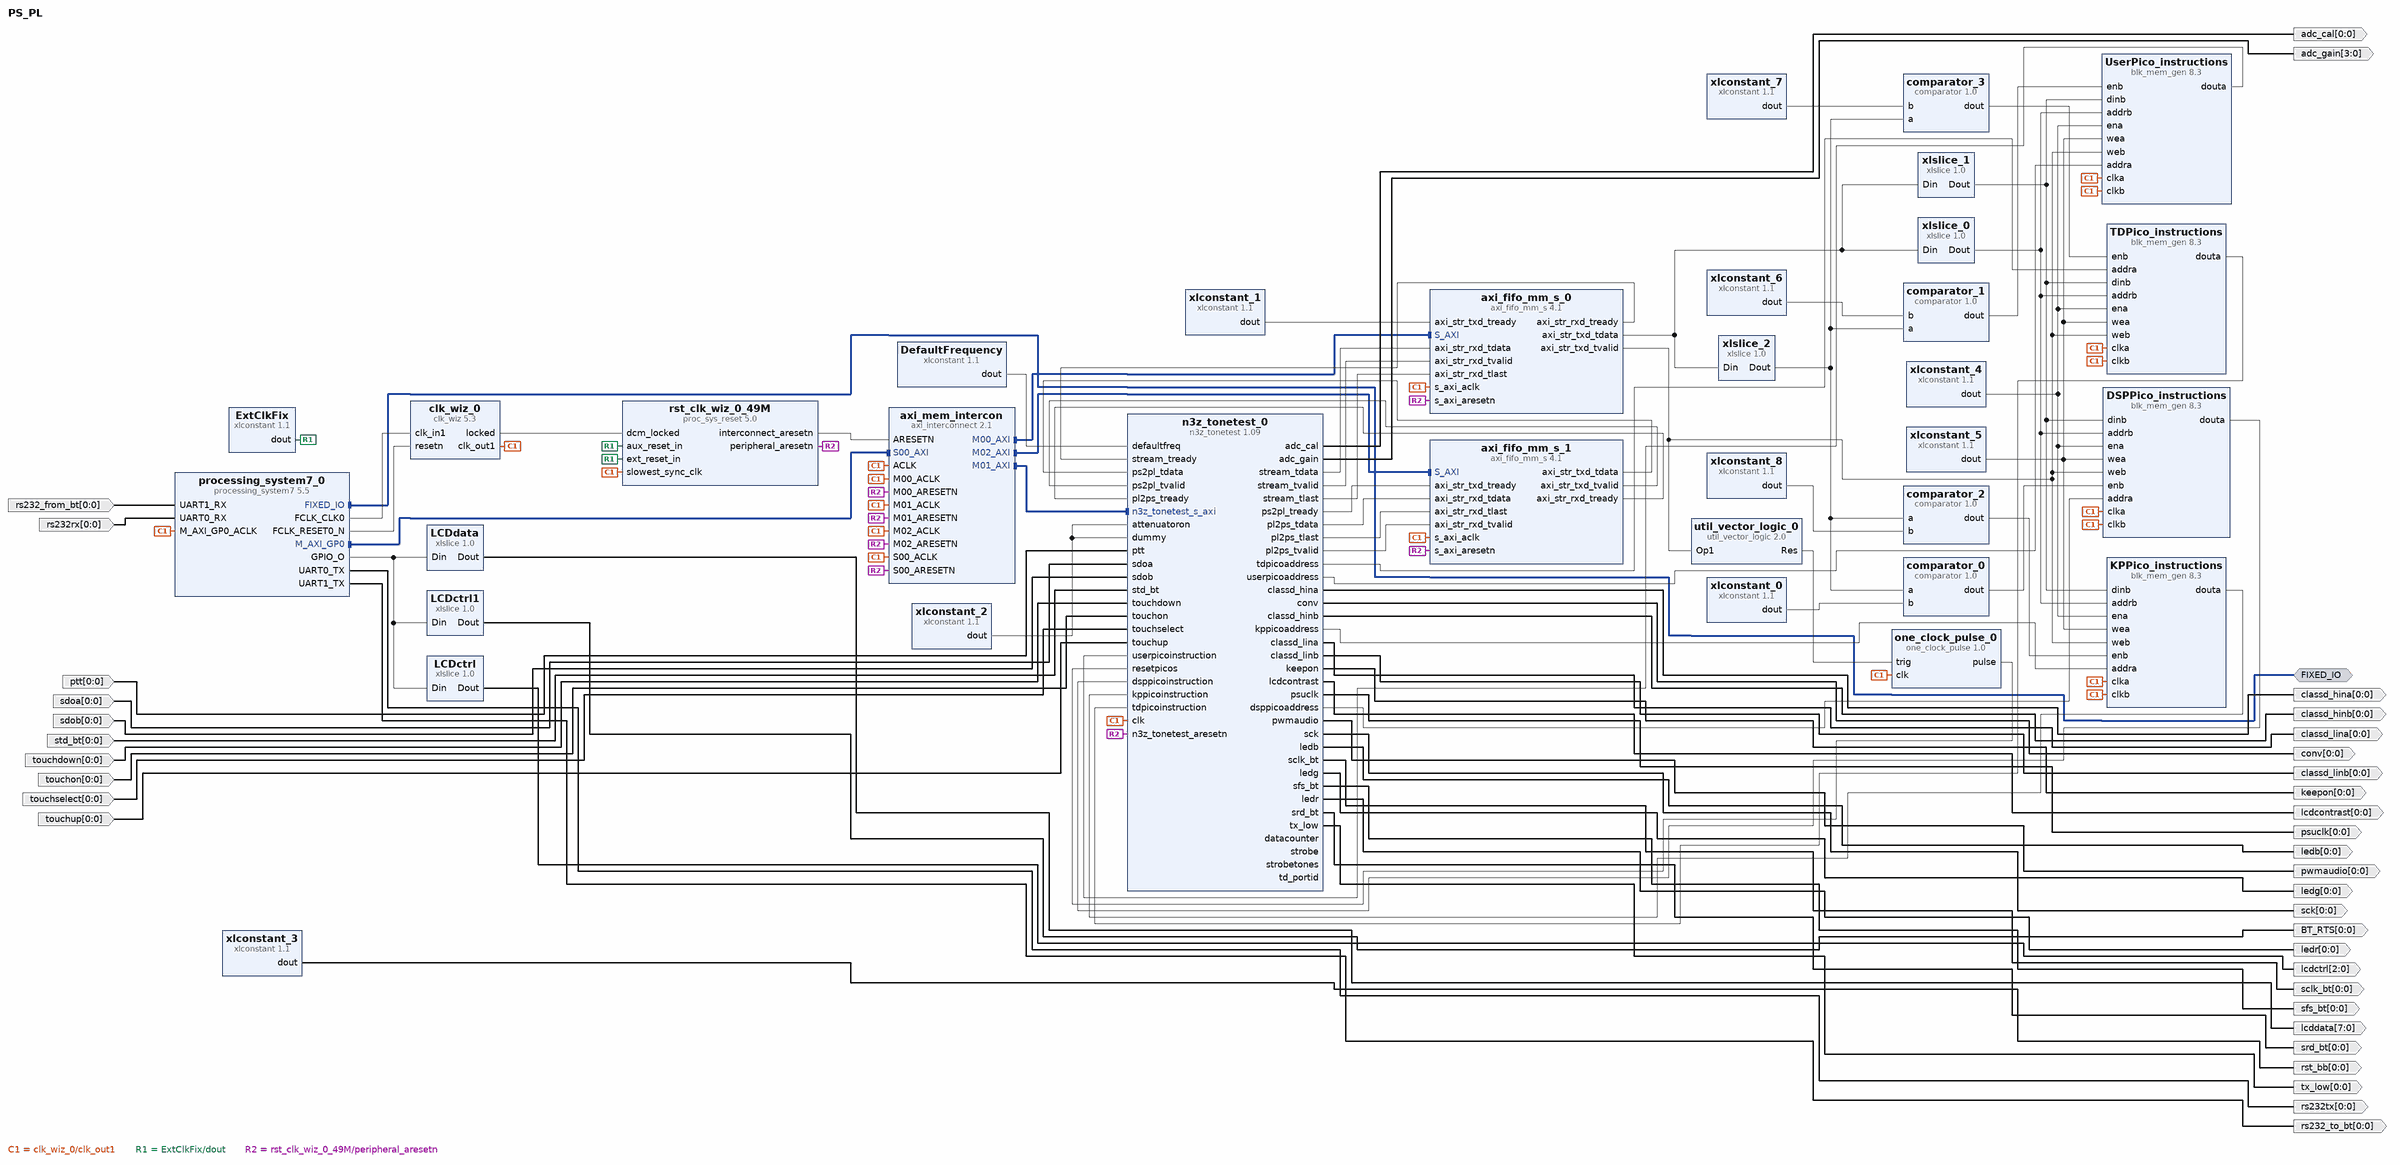
[diagram p0: block diagram of the top level]
# Vivado block design PS_PL, Vivado 2016.2
create_bd_design PS_PL

create_bd_intf_port -mode Master -vlnv xilinx.com:display_processing_system7:fixedio_rtl:1.0 FIXED_IO
create_bd_port -dir I -from 0 -to 0 -type data ptt
set_property -dict [list \
  CONFIG.LAYERED_METADATA {xilinx.com:interface:datatypes:1.0 {DATA {datatype {name {attribs {resolve_type immediate dependency {} format string minimum {} maximum {}} value {}} bitwidth {attribs {resolve_type immediate dependency {} format long minimum {} maximum {}} value 1} bitoffset {attribs {resolve_type immediate dependency {} format long minimum {} maximum {}} value 0} real {fixed {fractwidth {attribs {resolve_type immediate dependency {} format long minimum {} maximum {}} value 0} signed {attribs {resolve_type immediate dependency {} format bool minimum {} maximum {}} value false}}}}}}} \
] [get_bd_ports ptt]
create_bd_port -dir I -from 0 -to 0 -type data sdoa
set_property -dict [list \
  CONFIG.LAYERED_METADATA {xilinx.com:interface:datatypes:1.0 {DATA {datatype {name {attribs {resolve_type immediate dependency {} format string minimum {} maximum {}} value {}} bitwidth {attribs {resolve_type immediate dependency {} format long minimum {} maximum {}} value 1} bitoffset {attribs {resolve_type immediate dependency {} format long minimum {} maximum {}} value 0} real {fixed {fractwidth {attribs {resolve_type immediate dependency {} format long minimum {} maximum {}} value 0} signed {attribs {resolve_type immediate dependency {} format bool minimum {} maximum {}} value false}}}}}}} \
] [get_bd_ports sdoa]
create_bd_port -dir I -from 0 -to 0 -type data sdob
set_property -dict [list \
  CONFIG.LAYERED_METADATA {xilinx.com:interface:datatypes:1.0 {DATA {datatype {name {attribs {resolve_type immediate dependency {} format string minimum {} maximum {}} value {}} bitwidth {attribs {resolve_type immediate dependency {} format long minimum {} maximum {}} value 1} bitoffset {attribs {resolve_type immediate dependency {} format long minimum {} maximum {}} value 0} real {fixed {fractwidth {attribs {resolve_type immediate dependency {} format long minimum {} maximum {}} value 0} signed {attribs {resolve_type immediate dependency {} format bool minimum {} maximum {}} value false}}}}}}} \
] [get_bd_ports sdob]
create_bd_port -dir I -from 0 -to 0 -type data std_bt
set_property -dict [list \
  CONFIG.LAYERED_METADATA {xilinx.com:interface:datatypes:1.0 {DATA {datatype {name {attribs {resolve_type immediate dependency {} format string minimum {} maximum {}} value {}} bitwidth {attribs {resolve_type immediate dependency {} format long minimum {} maximum {}} value 1} bitoffset {attribs {resolve_type immediate dependency {} format long minimum {} maximum {}} value 0} real {fixed {fractwidth {attribs {resolve_type immediate dependency {} format long minimum {} maximum {}} value 0} signed {attribs {resolve_type immediate dependency {} format bool minimum {} maximum {}} value false}}}}}}} \
] [get_bd_ports std_bt]
create_bd_port -dir I -from 0 -to 0 -type data touchdown
set_property -dict [list \
  CONFIG.LAYERED_METADATA {xilinx.com:interface:datatypes:1.0 {DATA {datatype {name {attribs {resolve_type immediate dependency {} format string minimum {} maximum {}} value {}} bitwidth {attribs {resolve_type immediate dependency {} format long minimum {} maximum {}} value 1} bitoffset {attribs {resolve_type immediate dependency {} format long minimum {} maximum {}} value 0} real {fixed {fractwidth {attribs {resolve_type immediate dependency {} format long minimum {} maximum {}} value 0} signed {attribs {resolve_type immediate dependency {} format bool minimum {} maximum {}} value false}}}}}}} \
] [get_bd_ports touchdown]
create_bd_port -dir I -from 0 -to 0 -type data touchon
set_property -dict [list \
  CONFIG.LAYERED_METADATA {xilinx.com:interface:datatypes:1.0 {DATA {datatype {name {attribs {resolve_type immediate dependency {} format string minimum {} maximum {}} value {}} bitwidth {attribs {resolve_type immediate dependency {} format long minimum {} maximum {}} value 1} bitoffset {attribs {resolve_type immediate dependency {} format long minimum {} maximum {}} value 0} real {fixed {fractwidth {attribs {resolve_type immediate dependency {} format long minimum {} maximum {}} value 0} signed {attribs {resolve_type immediate dependency {} format bool minimum {} maximum {}} value false}}}}}}} \
] [get_bd_ports touchon]
create_bd_port -dir I -from 0 -to 0 -type data touchselect
set_property -dict [list \
  CONFIG.LAYERED_METADATA {xilinx.com:interface:datatypes:1.0 {DATA {datatype {name {attribs {resolve_type immediate dependency {} format string minimum {} maximum {}} value {}} bitwidth {attribs {resolve_type immediate dependency {} format long minimum {} maximum {}} value 1} bitoffset {attribs {resolve_type immediate dependency {} format long minimum {} maximum {}} value 0} real {fixed {fractwidth {attribs {resolve_type immediate dependency {} format long minimum {} maximum {}} value 0} signed {attribs {resolve_type immediate dependency {} format bool minimum {} maximum {}} value false}}}}}}} \
] [get_bd_ports touchselect]
create_bd_port -dir I -from 0 -to 0 -type data touchup
set_property -dict [list \
  CONFIG.LAYERED_METADATA {xilinx.com:interface:datatypes:1.0 {DATA {datatype {name {attribs {resolve_type immediate dependency {} format string minimum {} maximum {}} value {}} bitwidth {attribs {resolve_type immediate dependency {} format long minimum {} maximum {}} value 1} bitoffset {attribs {resolve_type immediate dependency {} format long minimum {} maximum {}} value 0} real {fixed {fractwidth {attribs {resolve_type immediate dependency {} format long minimum {} maximum {}} value 0} signed {attribs {resolve_type immediate dependency {} format bool minimum {} maximum {}} value false}}}}}}} \
] [get_bd_ports touchup]
create_bd_port -dir O -from 0 -to 0 -type data adc_cal
create_bd_port -dir O -from 3 -to 0 -type data adc_gain
create_bd_port -dir O -from 0 -to 0 -type data conv
create_bd_port -dir O -from 0 -to 0 -type data classd_hina
create_bd_port -dir O -from 0 -to 0 -type data classd_hinb
create_bd_port -dir O -from 0 -to 0 -type data classd_lina
create_bd_port -dir O -from 0 -to 0 -type data classd_linb
create_bd_port -dir O -from 0 -to 0 -type data keepon
create_bd_port -dir O -from 0 -to 0 -type data lcdcontrast
create_bd_port -dir O -from 0 -to 0 -type data psuclk
create_bd_port -dir O -from 0 -to 0 -type data pwmaudio
create_bd_port -dir O -from 0 -to 0 -type data rst_bb
create_bd_port -dir O -from 0 -to 0 -type data sck
create_bd_port -dir O -from 0 -to 0 -type data sclk_bt
create_bd_port -dir O -from 0 -to 0 -type data sfs_bt
create_bd_port -dir O -from 0 -to 0 -type data srd_bt
create_bd_port -dir O -from 0 -to 0 -type data tx_low
create_bd_port -dir O -from 0 -to 0 -type data rs232tx
create_bd_port -dir O -from 0 -to 0 -type data rs232_to_bt
create_bd_port -dir I -from 0 -to 0 -type data rs232_from_bt
set_property -dict [list \
  CONFIG.LAYERED_METADATA {xilinx.com:interface:datatypes:1.0 {DATA {datatype {name {attribs {resolve_type immediate dependency {} format string minimum {} maximum {}} value {}} bitwidth {attribs {resolve_type immediate dependency {} format long minimum {} maximum {}} value 1} bitoffset {attribs {resolve_type immediate dependency {} format long minimum {} maximum {}} value 0} real {fixed {fractwidth {attribs {resolve_type immediate dependency {} format long minimum {} maximum {}} value 0} signed {attribs {resolve_type immediate dependency {} format bool minimum {} maximum {}} value false}}}}}}} \
] [get_bd_ports rs232_from_bt]
create_bd_port -dir I -from 0 -to 0 -type data rs232rx
set_property -dict [list \
  CONFIG.LAYERED_METADATA {xilinx.com:interface:datatypes:1.0 {DATA {datatype {name {attribs {resolve_type immediate dependency {} format string minimum {} maximum {}} value {}} bitwidth {attribs {resolve_type immediate dependency {} format long minimum {} maximum {}} value 1} bitoffset {attribs {resolve_type immediate dependency {} format long minimum {} maximum {}} value 0} real {fixed {fractwidth {attribs {resolve_type immediate dependency {} format long minimum {} maximum {}} value 0} signed {attribs {resolve_type immediate dependency {} format bool minimum {} maximum {}} value false}}}}}}} \
] [get_bd_ports rs232rx]
create_bd_port -dir O -from 2 -to 0 -type data lcdctrl
create_bd_port -dir O -from 7 -to 0 -type data lcddata
create_bd_port -dir O -from 0 -to 0 -type data ledb
create_bd_port -dir O -from 0 -to 0 -type data ledg
create_bd_port -dir O -from 0 -to 0 -type data ledr
create_bd_port -dir O -from 0 -to 0 BT_RTS

create_bd_cell -type ip -vlnv xilinx.com:ip:clk_wiz:5.3 clk_wiz_0
set_property -dict [list \
  CONFIG.PRIM_IN_FREQ 50 \
  CONFIG.CLKIN1_JITTER_PS 200.0 \
  CONFIG.CLKOUT1_REQUESTED_OUT_FREQ 49.152 \
  CONFIG.RESET_TYPE ACTIVE_LOW \
  CONFIG.CLKOUT1_JITTER 177.254 \
  CONFIG.CLKOUT1_PHASE_ERROR 162.020 \
] [get_bd_cells clk_wiz_0]
create_bd_cell -type ip -vlnv xilinx.com:ip:processing_system7:5.5 processing_system7_0
set_property -dict [list \
  CONFIG.PCW_SDIO_PERIPHERAL_FREQMHZ 125 \
  CONFIG.PCW_UIPARAM_DDR_ENABLE 0 \
  CONFIG.PCW_QSPI_PERIPHERAL_ENABLE 1 \
  CONFIG.PCW_QSPI_GRP_SINGLE_SS_ENABLE 1 \
  CONFIG.PCW_SD0_PERIPHERAL_ENABLE 1 \
  CONFIG.PCW_SD0_SD0_IO {MIO 28 .. 33} \
  CONFIG.PCW_UART0_PERIPHERAL_ENABLE 1 \
  CONFIG.PCW_UART1_PERIPHERAL_ENABLE 1 \
  CONFIG.PCW_UART1_UART1_IO EMIO \
  CONFIG.PCW_GPIO_MIO_GPIO_ENABLE 0 \
  CONFIG.PCW_GPIO_EMIO_GPIO_ENABLE 1 \
  CONFIG.PCW_GPIO_EMIO_GPIO_IO 16 \
] [get_bd_cells processing_system7_0]
# 2 more settings of processing_system7_0 are not shown: defaults, MIO pin electricals, DDR timing, and values the tool derives
create_bd_cell -type ip -vlnv xilinx.com:ip:proc_sys_reset:5.0 rst_clk_wiz_0_49M
set_property -dict {CONFIG.C_AUX_RESET_HIGH 0} [get_bd_cells rst_clk_wiz_0_49M]
create_bd_cell -type ip -vlnv xilinx.com:ip:xlconstant:1.1 DefaultFrequency
set_property -dict {CONFIG.CONST_WIDTH 2 CONFIG.CONST_VAL 1} [get_bd_cells DefaultFrequency]
create_bd_cell -type ip -vlnv xilinx.com:ip:xlconstant:1.1 xlconstant_2
create_bd_cell -type ip -vlnv xilinx.com:ip:xlconstant:1.1 ExtClkFix
set_property -dict {CONFIG.CONST_WIDTH 4 CONFIG.CONST_VAL 15} [get_bd_cells ExtClkFix]
create_bd_cell -type ip -vlnv xilinx.com:ip:axi_interconnect:2.1 axi_mem_intercon
set_property -dict [list \
  CONFIG.NUM_MI 3 \
  CONFIG.M01_HAS_REGSLICE 0 \
  CONFIG.M01_HAS_DATA_FIFO 0 \
  CONFIG.S00_HAS_DATA_FIFO 0 \
] [get_bd_cells axi_mem_intercon]
create_bd_cell -type ip -vlnv xilinx.com:ip:axi_fifo_mm_s:4.1 axi_fifo_mm_s_0
set_property -dict [list \
  CONFIG.C_RX_FIFO_PE_THRESHOLD 2 \
  CONFIG.C_RX_FIFO_PF_THRESHOLD 4000 \
  CONFIG.C_TX_FIFO_PE_THRESHOLD 2 \
  CONFIG.C_TX_FIFO_PF_THRESHOLD 2043 \
  CONFIG.C_RX_FIFO_DEPTH 16384 \
  CONFIG.C_TX_FIFO_DEPTH 2048 \
  CONFIG.C_HAS_AXIS_TUSER false \
  CONFIG.C_HAS_AXIS_TDEST false \
  CONFIG.C_AXIS_TUSER_WIDTH 4 \
  CONFIG.C_AXIS_TDEST_WIDTH 4 \
  CONFIG.C_USE_TX_DATA 1 \
  CONFIG.C_USE_RX_DATA 1 \
  CONFIG.C_USE_TX_CTRL 0 \
] [get_bd_cells axi_fifo_mm_s_0]
create_bd_cell -type ip -vlnv xilinx.com:ip:xlconstant:1.1 xlconstant_3
set_property -dict {CONFIG.CONST_VAL 0} [get_bd_cells xlconstant_3]
create_bd_cell -type ip -vlnv xilinx.com:ip:axi_fifo_mm_s:4.1 axi_fifo_mm_s_1
set_property -dict [list \
  CONFIG.C_HAS_AXIS_TDEST false \
  CONFIG.C_AXIS_TDEST_WIDTH 4 \
  CONFIG.C_USE_TX_CTRL 0 \
] [get_bd_cells axi_fifo_mm_s_1]
create_bd_cell -type ip -vlnv xilinx.com:ip:xlslice:1.0 LCDdata
set_property -dict {CONFIG.DOUT_WIDTH 8 CONFIG.DIN_TO 0 CONFIG.DIN_FROM 7 CONFIG.DIN_WIDTH 16} [get_bd_cells LCDdata]
create_bd_cell -type ip -vlnv xilinx.com:ip:xlslice:1.0 LCDctrl
set_property -dict {CONFIG.DOUT_WIDTH 3 CONFIG.DIN_TO 8 CONFIG.DIN_FROM 10 CONFIG.DIN_WIDTH 16} [get_bd_cells LCDctrl]
create_bd_cell -type ip -vlnv xilinx.com:ip:xlconstant:1.1 xlconstant_0
set_property -dict {CONFIG.CONST_WIDTH 3 CONFIG.CONST_VAL 1} [get_bd_cells xlconstant_0]
create_bd_cell -type ip -vlnv xilinx.com:ip:xlslice:1.0 xlslice_0
set_property -dict {CONFIG.DOUT_WIDTH 11 CONFIG.DIN_FROM 10} [get_bd_cells xlslice_0]
create_bd_cell -type ip -vlnv xilinx.com:ip:xlslice:1.0 xlslice_1
set_property -dict {CONFIG.DOUT_WIDTH 18 CONFIG.DIN_TO 11 CONFIG.DIN_FROM 28} [get_bd_cells xlslice_1]
create_bd_cell -type ip -vlnv xilinx.com:ip:xlslice:1.0 xlslice_2
set_property -dict {CONFIG.DOUT_WIDTH 3 CONFIG.DIN_TO 29 CONFIG.DIN_FROM 31} [get_bd_cells xlslice_2]
create_bd_cell -type ip -vlnv xilinx.com:ip:xlconstant:1.1 xlconstant_1
create_bd_cell -type ip -vlnv xilinx.com:ip:xlconstant:1.1 xlconstant_4
create_bd_cell -type ip -vlnv xilinx.com:ip:xlconstant:1.1 xlconstant_5
set_property -dict {CONFIG.CONST_VAL 0} [get_bd_cells xlconstant_5]
create_bd_cell -type ip -vlnv koheron:user:comparator:1.0 comparator_0
set_property -dict {CONFIG.DATA_WIDTH 3} [get_bd_cells comparator_0]
create_bd_cell -type ip -vlnv koheron:user:comparator:1.0 comparator_1
set_property -dict {CONFIG.DATA_WIDTH 3} [get_bd_cells comparator_1]
create_bd_cell -type ip -vlnv xilinx.com:ip:xlconstant:1.1 xlconstant_6
set_property -dict {CONFIG.CONST_WIDTH 3 CONFIG.CONST_VAL 0} [get_bd_cells xlconstant_6]
create_bd_cell -type ip -vlnv koheron:user:comparator:1.0 comparator_2
set_property -dict {CONFIG.DATA_WIDTH 3} [get_bd_cells comparator_2]
create_bd_cell -type ip -vlnv koheron:user:comparator:1.0 comparator_3
set_property -dict {CONFIG.DATA_WIDTH 3} [get_bd_cells comparator_3]
create_bd_cell -type ip -vlnv xilinx.com:ip:xlconstant:1.1 xlconstant_7
set_property -dict {CONFIG.CONST_WIDTH 3 CONFIG.CONST_VAL 3} [get_bd_cells xlconstant_7]
create_bd_cell -type ip -vlnv xilinx.com:ip:xlconstant:1.1 xlconstant_8
set_property -dict {CONFIG.CONST_WIDTH 3 CONFIG.CONST_VAL 2} [get_bd_cells xlconstant_8]
create_bd_cell -type ip -vlnv CCFE:user:one_clock_pulse:1.0 one_clock_pulse_0
create_bd_cell -type ip -vlnv xilinx.com:ip:util_vector_logic:2.0 util_vector_logic_0
set_property -dict {CONFIG.C_SIZE 1 CONFIG.C_OPERATION not} [get_bd_cells util_vector_logic_0]
create_bd_cell -type ip -vlnv xilinx.com:ip:blk_mem_gen:8.3 UserPico_instructions
set_property -dict [list \
  CONFIG.Memory_Type True_Dual_Port_RAM \
  CONFIG.Enable_32bit_Address false \
  CONFIG.Use_Byte_Write_Enable false \
  CONFIG.Write_Width_A 18 \
  CONFIG.Write_Depth_A 2048 \
  CONFIG.Read_Width_A 18 \
  CONFIG.Write_Width_B 18 \
  CONFIG.Read_Width_B 18 \
  CONFIG.Operating_Mode_B READ_FIRST \
  CONFIG.Enable_B Use_ENB_Pin \
  CONFIG.Register_PortA_Output_of_Memory_Primitives false \
  CONFIG.Register_PortB_Output_of_Memory_Primitives false \
  CONFIG.Load_Init_File true \
  CONFIG.Coe_File ../../../../../../../../../../N3SysGen/UserPico.coe \
  CONFIG.Use_RSTA_Pin false \
  CONFIG.Use_RSTB_Pin false \
  CONFIG.Port_B_Clock 100 \
  CONFIG.Port_B_Write_Rate 50 \
  CONFIG.Port_B_Enable_Rate 100 \
  CONFIG.use_bram_block Stand_Alone \
] [get_bd_cells UserPico_instructions]
create_bd_cell -type ip -vlnv xilinx.com:ip:blk_mem_gen:8.3 DSPPico_instructions
set_property -dict [list \
  CONFIG.Memory_Type True_Dual_Port_RAM \
  CONFIG.Enable_32bit_Address false \
  CONFIG.Use_Byte_Write_Enable false \
  CONFIG.Write_Width_A 18 \
  CONFIG.Write_Depth_A 2048 \
  CONFIG.Read_Width_A 18 \
  CONFIG.Write_Width_B 18 \
  CONFIG.Read_Width_B 18 \
  CONFIG.Operating_Mode_B READ_FIRST \
  CONFIG.Enable_B Use_ENB_Pin \
  CONFIG.Register_PortA_Output_of_Memory_Primitives false \
  CONFIG.Register_PortB_Output_of_Memory_Primitives false \
  CONFIG.Load_Init_File true \
  CONFIG.Coe_File ../../../../../../../../../../N3SysGen/DSPpico.coe \
  CONFIG.Use_RSTA_Pin false \
  CONFIG.Use_RSTB_Pin false \
  CONFIG.Port_B_Clock 100 \
  CONFIG.Port_B_Write_Rate 50 \
  CONFIG.Port_B_Enable_Rate 100 \
  CONFIG.use_bram_block Stand_Alone \
] [get_bd_cells DSPPico_instructions]
create_bd_cell -type ip -vlnv xilinx.com:ip:blk_mem_gen:8.3 KPPico_instructions
set_property -dict [list \
  CONFIG.Memory_Type True_Dual_Port_RAM \
  CONFIG.Enable_32bit_Address false \
  CONFIG.Use_Byte_Write_Enable false \
  CONFIG.Write_Width_A 18 \
  CONFIG.Write_Depth_A 2048 \
  CONFIG.Read_Width_A 18 \
  CONFIG.Write_Width_B 18 \
  CONFIG.Read_Width_B 18 \
  CONFIG.Operating_Mode_B READ_FIRST \
  CONFIG.Enable_B Use_ENB_Pin \
  CONFIG.Register_PortA_Output_of_Memory_Primitives false \
  CONFIG.Register_PortB_Output_of_Memory_Primitives false \
  CONFIG.Load_Init_File true \
  CONFIG.Coe_File ../../../../../../../../../../N3SysGen/KeyPadPico.coe \
  CONFIG.Use_RSTA_Pin false \
  CONFIG.Use_RSTB_Pin false \
  CONFIG.Port_B_Clock 100 \
  CONFIG.Port_B_Write_Rate 50 \
  CONFIG.Port_B_Enable_Rate 100 \
  CONFIG.use_bram_block Stand_Alone \
] [get_bd_cells KPPico_instructions]
create_bd_cell -type ip -vlnv xilinx.com:ip:blk_mem_gen:8.3 TDPico_instructions
set_property -dict [list \
  CONFIG.Memory_Type True_Dual_Port_RAM \
  CONFIG.Enable_32bit_Address false \
  CONFIG.Use_Byte_Write_Enable false \
  CONFIG.Write_Width_A 18 \
  CONFIG.Write_Depth_A 2048 \
  CONFIG.Read_Width_A 18 \
  CONFIG.Write_Width_B 18 \
  CONFIG.Read_Width_B 18 \
  CONFIG.Operating_Mode_B READ_FIRST \
  CONFIG.Enable_B Use_ENB_Pin \
  CONFIG.Register_PortA_Output_of_Memory_Primitives false \
  CONFIG.Register_PortB_Output_of_Memory_Primitives false \
  CONFIG.Load_Init_File true \
  CONFIG.Coe_File ../../../../../../../../../../N3SysGen/ToneDetectpico.coe \
  CONFIG.Use_RSTA_Pin false \
  CONFIG.Use_RSTB_Pin false \
  CONFIG.Port_B_Clock 100 \
  CONFIG.Port_B_Write_Rate 50 \
  CONFIG.Port_B_Enable_Rate 100 \
  CONFIG.use_bram_block Stand_Alone \
] [get_bd_cells TDPico_instructions]
create_bd_cell -type ip -vlnv AssociationNicola:SysGen:n3z_tonetest:1.09 n3z_tonetest_0
create_bd_cell -type ip -vlnv xilinx.com:ip:xlslice:1.0 LCDctrl1
set_property -dict {CONFIG.DOUT_WIDTH 1 CONFIG.DIN_TO 12 CONFIG.DIN_FROM 12 CONFIG.DIN_WIDTH 16} [get_bd_cells LCDctrl1]

# ---- connections ----

connect_bd_intf_net [get_bd_intf_pins processing_system7_0/M_AXI_GP0] [get_bd_intf_pins axi_mem_intercon/S00_AXI]
connect_bd_intf_net [get_bd_intf_pins axi_mem_intercon/M01_AXI] [get_bd_intf_pins n3z_tonetest_0/n3z_tonetest_s_axi]
connect_bd_intf_net [get_bd_intf_pins axi_mem_intercon/M00_AXI] [get_bd_intf_pins axi_fifo_mm_s_0/S_AXI]
connect_bd_intf_net [get_bd_intf_pins axi_mem_intercon/M02_AXI] [get_bd_intf_pins axi_fifo_mm_s_1/S_AXI]
connect_bd_intf_net [get_bd_intf_ports FIXED_IO] [get_bd_intf_pins processing_system7_0/FIXED_IO]
connect_bd_net [get_bd_pins processing_system7_0/FCLK_CLK0] [get_bd_pins clk_wiz_0/clk_in1]
connect_bd_net [get_bd_pins processing_system7_0/FCLK_RESET0_N] [get_bd_pins clk_wiz_0/resetn]
connect_bd_net [get_bd_pins DefaultFrequency/dout] [get_bd_pins n3z_tonetest_0/defaultfreq]
connect_bd_net [get_bd_ports ptt] [get_bd_pins n3z_tonetest_0/ptt]
connect_bd_net [get_bd_ports sdoa] [get_bd_pins n3z_tonetest_0/sdoa]
connect_bd_net [get_bd_ports sdob] [get_bd_pins n3z_tonetest_0/sdob]
connect_bd_net [get_bd_ports std_bt] [get_bd_pins n3z_tonetest_0/std_bt]
connect_bd_net [get_bd_ports touchdown] [get_bd_pins n3z_tonetest_0/touchdown]
connect_bd_net [get_bd_ports touchon] [get_bd_pins n3z_tonetest_0/touchon]
connect_bd_net [get_bd_ports touchselect] [get_bd_pins n3z_tonetest_0/touchselect]
connect_bd_net [get_bd_ports touchup] [get_bd_pins n3z_tonetest_0/touchup]
connect_bd_net [get_bd_pins n3z_tonetest_0/adc_cal] [get_bd_ports adc_cal]
connect_bd_net [get_bd_pins n3z_tonetest_0/adc_gain] [get_bd_ports adc_gain]
connect_bd_net [get_bd_pins n3z_tonetest_0/conv] [get_bd_ports conv]
connect_bd_net [get_bd_pins n3z_tonetest_0/classd_hina] [get_bd_ports classd_hina]
connect_bd_net [get_bd_pins n3z_tonetest_0/classd_hinb] [get_bd_ports classd_hinb]
connect_bd_net [get_bd_pins n3z_tonetest_0/classd_lina] [get_bd_ports classd_lina]
connect_bd_net [get_bd_pins n3z_tonetest_0/classd_linb] [get_bd_ports classd_linb]
connect_bd_net [get_bd_pins n3z_tonetest_0/keepon] [get_bd_ports keepon]
connect_bd_net [get_bd_pins n3z_tonetest_0/lcdcontrast] [get_bd_ports lcdcontrast]
connect_bd_net [get_bd_pins n3z_tonetest_0/psuclk] [get_bd_ports psuclk]
connect_bd_net [get_bd_pins n3z_tonetest_0/pwmaudio] [get_bd_ports pwmaudio]
connect_bd_net -net n3z_tonetest_0_rst_bb [get_bd_pins xlconstant_3/dout] [get_bd_ports rst_bb]
connect_bd_net [get_bd_pins n3z_tonetest_0/sck] [get_bd_ports sck]
connect_bd_net [get_bd_pins n3z_tonetest_0/sclk_bt] [get_bd_ports sclk_bt]
connect_bd_net [get_bd_pins n3z_tonetest_0/sfs_bt] [get_bd_ports sfs_bt]
connect_bd_net [get_bd_pins n3z_tonetest_0/srd_bt] [get_bd_ports srd_bt]
connect_bd_net [get_bd_pins n3z_tonetest_0/tx_low] [get_bd_ports tx_low]
connect_bd_net [get_bd_pins clk_wiz_0/locked] [get_bd_pins rst_clk_wiz_0_49M/dcm_locked]
connect_bd_net [get_bd_pins clk_wiz_0/clk_out1] \
  [get_bd_pins processing_system7_0/M_AXI_GP0_ACLK] [get_bd_pins rst_clk_wiz_0_49M/slowest_sync_clk] \
  [get_bd_pins axi_fifo_mm_s_0/s_axi_aclk] [get_bd_pins axi_fifo_mm_s_1/s_axi_aclk] [get_bd_pins one_clock_pulse_0/clk] \
  [get_bd_pins UserPico_instructions/clka] [get_bd_pins UserPico_instructions/clkb] [get_bd_pins DSPPico_instructions/clka] \
  [get_bd_pins DSPPico_instructions/clkb] [get_bd_pins KPPico_instructions/clka] [get_bd_pins KPPico_instructions/clkb] \
  [get_bd_pins TDPico_instructions/clka] [get_bd_pins TDPico_instructions/clkb] [get_bd_pins axi_mem_intercon/S00_ACLK] \
  [get_bd_pins axi_mem_intercon/ACLK] [get_bd_pins axi_mem_intercon/M00_ACLK] [get_bd_pins axi_mem_intercon/M01_ACLK] \
  [get_bd_pins axi_mem_intercon/M02_ACLK] [get_bd_pins n3z_tonetest_0/clk]
connect_bd_net [get_bd_pins xlconstant_2/dout] [get_bd_pins n3z_tonetest_0/attenuatoron] [get_bd_pins n3z_tonetest_0/dummy]
connect_bd_net -net DefaultFrequency1_dout [get_bd_pins ExtClkFix/dout] \
  [get_bd_pins rst_clk_wiz_0_49M/ext_reset_in] [get_bd_pins rst_clk_wiz_0_49M/aux_reset_in]
connect_bd_net [get_bd_pins processing_system7_0/UART0_TX] [get_bd_ports rs232tx]
connect_bd_net [get_bd_pins processing_system7_0/UART1_TX] [get_bd_ports rs232_to_bt]
connect_bd_net [get_bd_ports rs232_from_bt] [get_bd_pins processing_system7_0/UART1_RX]
connect_bd_net [get_bd_ports rs232rx] [get_bd_pins processing_system7_0/UART0_RX]
connect_bd_net [get_bd_pins rst_clk_wiz_0_49M/interconnect_aresetn] [get_bd_pins axi_mem_intercon/ARESETN]
connect_bd_net [get_bd_pins rst_clk_wiz_0_49M/peripheral_aresetn] \
  [get_bd_pins axi_fifo_mm_s_0/s_axi_aresetn] [get_bd_pins axi_fifo_mm_s_1/s_axi_aresetn] \
  [get_bd_pins axi_mem_intercon/S00_ARESETN] [get_bd_pins axi_mem_intercon/M00_ARESETN] \
  [get_bd_pins axi_mem_intercon/M01_ARESETN] [get_bd_pins axi_mem_intercon/M02_ARESETN] \
  [get_bd_pins n3z_tonetest_0/n3z_tonetest_aresetn]
connect_bd_net [get_bd_pins n3z_tonetest_0/stream_tdata] [get_bd_pins axi_fifo_mm_s_0/axi_str_rxd_tdata]
connect_bd_net [get_bd_pins n3z_tonetest_0/stream_tvalid] [get_bd_pins axi_fifo_mm_s_0/axi_str_rxd_tvalid]
connect_bd_net [get_bd_pins axi_fifo_mm_s_1/axi_str_txd_tdata] [get_bd_pins n3z_tonetest_0/ps2pl_tdata]
connect_bd_net [get_bd_pins axi_fifo_mm_s_1/axi_str_txd_tvalid] [get_bd_pins n3z_tonetest_0/ps2pl_tvalid]
connect_bd_net [get_bd_pins n3z_tonetest_0/ps2pl_tready] [get_bd_pins axi_fifo_mm_s_1/axi_str_txd_tready]
connect_bd_net [get_bd_pins n3z_tonetest_0/pl2ps_tdata] [get_bd_pins axi_fifo_mm_s_1/axi_str_rxd_tdata]
connect_bd_net [get_bd_pins n3z_tonetest_0/pl2ps_tlast] [get_bd_pins axi_fifo_mm_s_1/axi_str_rxd_tlast]
connect_bd_net [get_bd_pins n3z_tonetest_0/pl2ps_tvalid] [get_bd_pins axi_fifo_mm_s_1/axi_str_rxd_tvalid]
connect_bd_net [get_bd_pins axi_fifo_mm_s_1/axi_str_rxd_tready] [get_bd_pins n3z_tonetest_0/pl2ps_tready]
connect_bd_net [get_bd_pins processing_system7_0/GPIO_O] [get_bd_pins LCDctrl/Din] [get_bd_pins LCDdata/Din] [get_bd_pins LCDctrl1/Din]
connect_bd_net [get_bd_pins LCDctrl/Dout] [get_bd_ports lcdctrl]
connect_bd_net [get_bd_pins LCDdata/Dout] [get_bd_ports lcddata]
connect_bd_net [get_bd_pins n3z_tonetest_0/stream_tlast] [get_bd_pins axi_fifo_mm_s_0/axi_str_rxd_tlast]
connect_bd_net [get_bd_pins axi_fifo_mm_s_0/axi_str_rxd_tready] [get_bd_pins n3z_tonetest_0/stream_tready]
# net datacounter has one end: n3z_tonetest_0/datacounter
connect_bd_net [get_bd_pins n3z_tonetest_0/ledb] [get_bd_ports ledb]
connect_bd_net [get_bd_pins n3z_tonetest_0/ledg] [get_bd_ports ledg]
connect_bd_net [get_bd_pins n3z_tonetest_0/ledr] [get_bd_ports ledr]
connect_bd_net -net tdpicoaddress [get_bd_pins n3z_tonetest_0/tdpicoaddress] [get_bd_pins TDPico_instructions/addra]
# net strobe has one end: n3z_tonetest_0/strobe
connect_bd_net [get_bd_pins n3z_tonetest_0/userpicoaddress] [get_bd_pins UserPico_instructions/addra]
connect_bd_net [get_bd_pins axi_fifo_mm_s_0/axi_str_txd_tdata] [get_bd_pins xlslice_0/Din] [get_bd_pins xlslice_1/Din] [get_bd_pins xlslice_2/Din]
connect_bd_net [get_bd_pins xlslice_0/Dout] \
  [get_bd_pins UserPico_instructions/addrb] [get_bd_pins DSPPico_instructions/addrb] [get_bd_pins KPPico_instructions/addrb] \
  [get_bd_pins TDPico_instructions/addrb]
connect_bd_net [get_bd_pins xlslice_1/Dout] \
  [get_bd_pins UserPico_instructions/dinb] [get_bd_pins DSPPico_instructions/dinb] [get_bd_pins KPPico_instructions/dinb] \
  [get_bd_pins TDPico_instructions/dinb]
connect_bd_net [get_bd_pins xlconstant_1/dout] [get_bd_pins axi_fifo_mm_s_0/axi_str_txd_tready]
connect_bd_net [get_bd_pins axi_fifo_mm_s_0/axi_str_txd_tvalid] \
  [get_bd_pins util_vector_logic_0/Op1] [get_bd_pins UserPico_instructions/web] [get_bd_pins DSPPico_instructions/web] \
  [get_bd_pins KPPico_instructions/web] [get_bd_pins TDPico_instructions/web]
connect_bd_net [get_bd_pins xlconstant_4/dout] \
  [get_bd_pins UserPico_instructions/ena] [get_bd_pins DSPPico_instructions/ena] [get_bd_pins KPPico_instructions/ena] \
  [get_bd_pins TDPico_instructions/ena]
connect_bd_net [get_bd_pins xlconstant_5/dout] \
  [get_bd_pins UserPico_instructions/wea] [get_bd_pins DSPPico_instructions/wea] [get_bd_pins KPPico_instructions/wea] \
  [get_bd_pins TDPico_instructions/wea]
connect_bd_net [get_bd_pins xlslice_2/Dout] \
  [get_bd_pins comparator_0/a] [get_bd_pins comparator_1/a] [get_bd_pins comparator_2/a] [get_bd_pins comparator_3/a]
connect_bd_net [get_bd_pins xlconstant_0/dout] [get_bd_pins comparator_0/b]
connect_bd_net [get_bd_pins n3z_tonetest_0/dsppicoaddress] [get_bd_pins DSPPico_instructions/addra]
connect_bd_net [get_bd_pins xlconstant_6/dout] [get_bd_pins comparator_1/b]
connect_bd_net -net xlconstant_0_dout1 [get_bd_pins xlconstant_8/dout] [get_bd_pins comparator_2/b]
connect_bd_net -net xlconstant_6_dout1 [get_bd_pins xlconstant_7/dout] [get_bd_pins comparator_3/b]
connect_bd_net [get_bd_pins comparator_2/dout] [get_bd_pins KPPico_instructions/enb]
connect_bd_net [get_bd_pins comparator_3/dout] [get_bd_pins TDPico_instructions/enb]
connect_bd_net [get_bd_pins comparator_0/dout] [get_bd_pins DSPPico_instructions/enb]
connect_bd_net [get_bd_pins comparator_1/dout] [get_bd_pins UserPico_instructions/enb]
connect_bd_net [get_bd_pins n3z_tonetest_0/kppicoaddress] [get_bd_pins KPPico_instructions/addra]
connect_bd_net [get_bd_pins util_vector_logic_0/Res] [get_bd_pins one_clock_pulse_0/trig]
connect_bd_net [get_bd_pins one_clock_pulse_0/pulse] [get_bd_pins n3z_tonetest_0/resetpicos]
# net strobetones has one end: n3z_tonetest_0/strobetones
# net td_portid has one end: n3z_tonetest_0/td_portid
connect_bd_net -net blk_mem_gen_1_douta [get_bd_pins DSPPico_instructions/douta] [get_bd_pins n3z_tonetest_0/dsppicoinstruction]
connect_bd_net -net blk_mem_gen_0_douta [get_bd_pins UserPico_instructions/douta] [get_bd_pins n3z_tonetest_0/userpicoinstruction]
connect_bd_net -net blk_mem_gen_2_douta [get_bd_pins KPPico_instructions/douta] [get_bd_pins n3z_tonetest_0/kppicoinstruction]
connect_bd_net -net blk_mem_gen_3_douta [get_bd_pins TDPico_instructions/douta] [get_bd_pins n3z_tonetest_0/tdpicoinstruction]
connect_bd_net [get_bd_pins LCDctrl1/Dout] [get_bd_ports BT_RTS]

# ---- address map ----
assign_bd_address -offset 0x43C00000 -range 64K -target_address_space [get_bd_addr_spaces processing_system7_0/Data] [get_bd_addr_segs n3z_tonetest_0/n3z_tonetest_s_axi/reg0]
assign_bd_address -offset 0x43C10000 -range 64K -target_address_space [get_bd_addr_spaces processing_system7_0/Data] [get_bd_addr_segs axi_fifo_mm_s_0/S_AXI/Mem0]
assign_bd_address -offset 0x43C20000 -range 64K -target_address_space [get_bd_addr_spaces processing_system7_0/Data] [get_bd_addr_segs axi_fifo_mm_s_1/S_AXI/Mem0]

validate_bd_design
save_bd_design
